# Altium schematic sheet Sensor.SchDoc
size A4; SheetNumber: 5; SheetTotal: 5
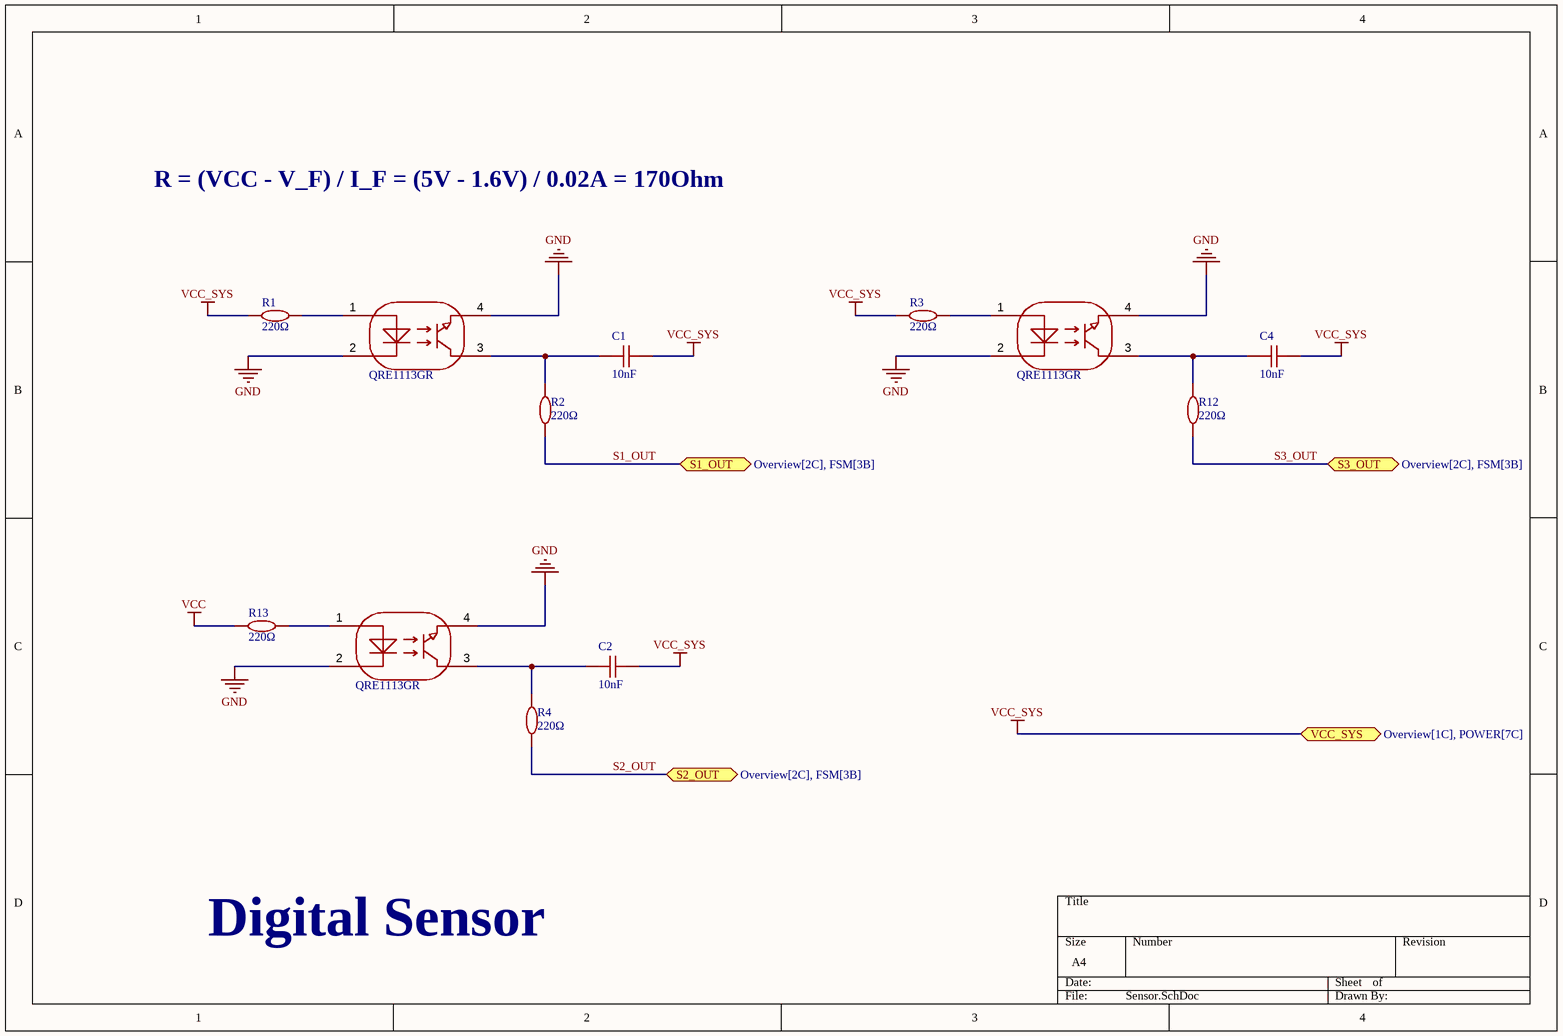
[diagram p0: Sensor.SchDoc]

## Parts
C1  10nF  [C0402]
C2  10nF  [C0402]
C4  10nF  [C0402]
R1  220Ω  [R0402]
R2  220Ω  [R0402]
R3  220Ω  [R0402]
R4  220Ω  [R0402]
R12  220Ω  [R0402]
R13  220Ω  [R0402]
U1  QRE1113GR  [OPTO-SMD_QRE1113GR]
U2  QRE1113GR  [OPTO-SMD_QRE1113GR]
U3  QRE1113GR  [OPTO-SMD_QRE1113GR]

## Ports
S1_OUT (bidir, see Overview[2C], FSM[3B]), S2_OUT (bidir, see Overview[2C], FSM[3B]), S3_OUT (bidir, see Overview[2C], FSM[3B]), VCC_SYS (bidir, see Overview[1C], POWER[7C])

## Nets
GND: U1.2 U1.4 U2.2 U2.4 U3.2 U3.4
VCC: R13.2
VCC_SYS: C1.2 C2.2 C4.2 R1.2 R3.2 ; port VCC_SYS
S1_OUT: R2.1 ; port S1_OUT
S2_OUT: R4.1 ; port S2_OUT
S3_OUT: R12.1 ; port S3_OUT
NetC1_1: C1.1 R2.2 U1.3
NetC2_1: C2.1 R4.2 U2.3
NetC4_1: C4.1 R12.2 U3.3
NetR1_1: R1.1 U1.1
NetR3_1: R3.1 U3.1
NetR13_1: R13.1 U2.1

## Notes on the sheet
- R = (VCC - V_F) / I_F = (5V - 1.6V) / 0.02A = 170Ohm
- Digital Sensor

## Library data of the parts
C1 C2 C4 = 10nF: 50V 10nF X7R ±10% 0402 Ceramic Capacitors ROHS
R1 R3 R13 = 100Ω: 100Ω 62.5mW 50V ±100ppm/℃ Thick Film Resistor ±1% 0402 Chip Resistor - Surface Mount ROHS
R2 R4 R12 = 220Ω: 小尺寸、重量轻。降低组装成本,与贴片机匹配。适用于波峰焊和回流焊
U1-U3 = QRE1113GR: QRE1113 由在塑料矩形盒体中与兼容硅光电晶体管并排封装的 940nm 发射极组成。采用表面贴装和通孔选项。; Symbol: QRE1113GR